# Altium schematic sheet Sheet1.SchDoc
size A
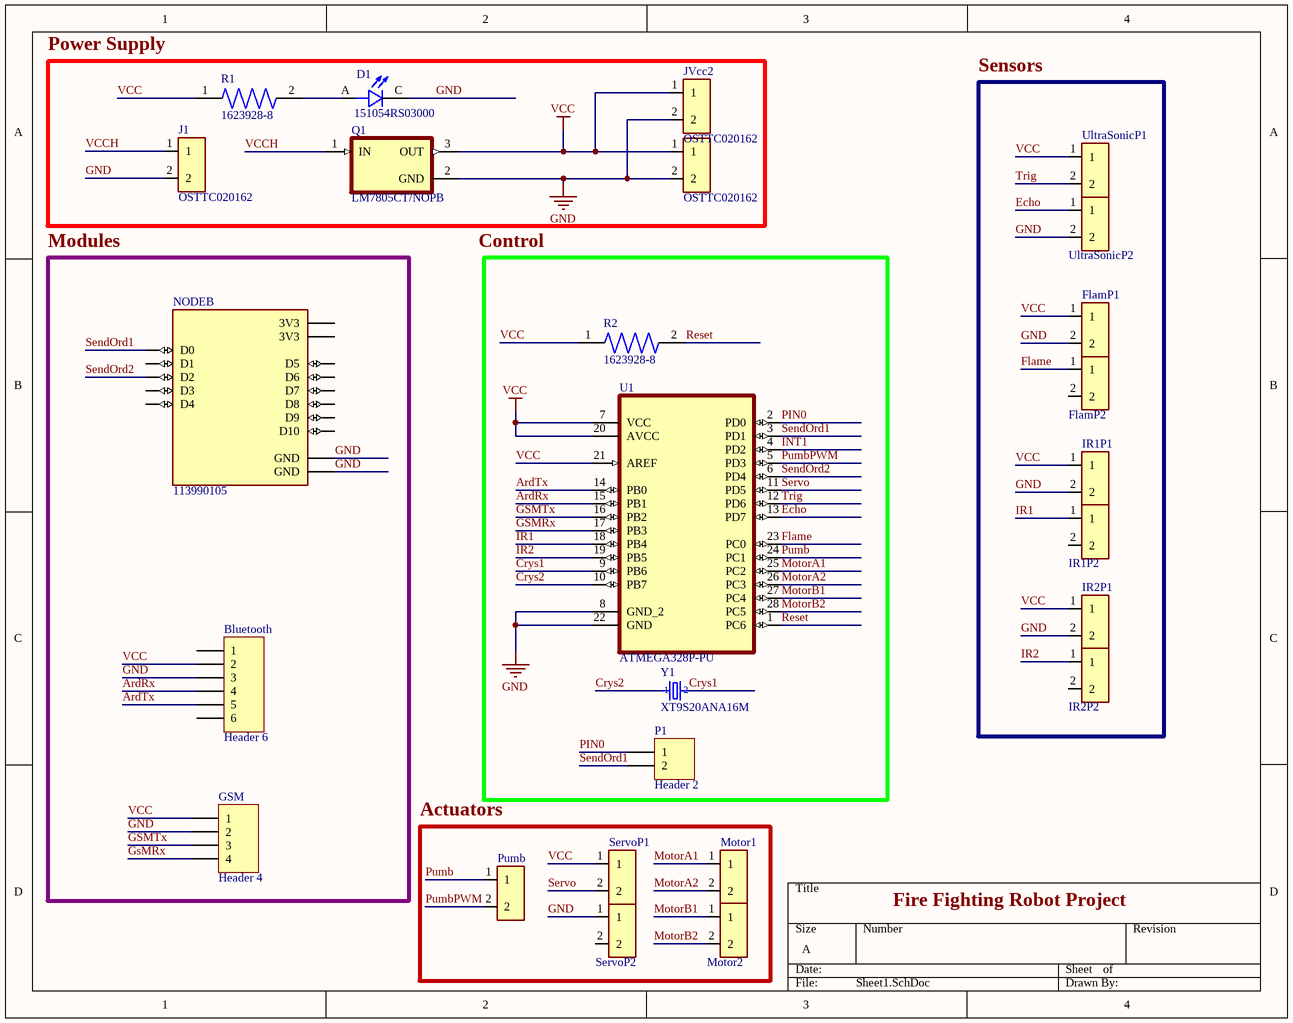
[diagram p0: Sheet1.SchDoc]

## Parts
Bluetooth  Header 6  [HDR1X6]
D1  151054RS03000  [LED_151054RS03000]
FlamP1  (no value)  [OST_OSTTC020162]
FlamP2  (no value)  [OST_OSTTC020162]
GSM  Header 4  [HDR1X4]
IR1P1  (no value)  [OST_OSTTC020162]
IR1P2  (no value)  [OST_OSTTC020162]
IR2P1  (no value)  [OST_OSTTC020162]
IR2P2  (no value)  [OST_OSTTC020162]
J1  OSTTC020162  [OST_OSTTC020162]
JVcc  OSTTC020162  [OST_OSTTC020162]
JVcc2  OSTTC020162  [OST_OSTTC020162]
Motor1  (no value)  [OST_OSTTC020162]
Motor2  (no value)  [OST_OSTTC020162]
NODE  113990105  [SEEED_113990105]  (part B of 2)
P1  Header 2  [HDR1X2]
Pumb  (no value)  [OST_OSTTC020162]
Q1  LM7805CT/NOPB  [TO254P1054X470X2600-3]
R1  1623928-8  [RESAD700W45L350D185]
R2  1623928-8  [RESAD700W45L350D185]
ServoP1  (no value)  [OST_OSTTC020162]
ServoP2  (no value)  [OST_OSTTC020162]
U1  ATMEGA328P-PU  [DIP254P762X457-28]
UltraSonicP1  (no value)  [OST_OSTTC020162]
UltraSonicP2  (no value)  [OST_OSTTC020162]
Y1  XT9S20ANA16M  [XTAL_XT9S20ANA16M]

## Blocks framed on the sheet
Power Supply: D1 J1 JVcc JVcc2 Q1 R1
Sensors: FlamP1 FlamP2 IR1P1 IR1P2 IR2P1 IR2P2 UltraSonicP1 UltraSonicP2
Modules: Bluetooth GSM NODE
Actuators: Motor1 Motor2 Pumb ServoP1 ServoP2

## Nets
GND: Bluetooth.3 D1.C FlamP1.2 GSM.2 IR1P1.2 IR2P1.2 J1.2 JVcc.2 JVcc2.2 NODE.J2_7(GND) NODE.J2_14(GND) Q1.2(GND) ServoP2.1 U1.8(GND_2) U1.22(GND) UltraSonicP2.2
VCC: Bluetooth.2 FlamP1.1 GSM.1 IR1P1.1 IR2P1.1 JVcc.1 JVcc2.1 Q1.3(OUT) R1.1 R2.1 ServoP1.1 U1.7(VCC) U1.20(AVCC) U1.21(AREF) UltraSonicP1.1
ArdRx: Bluetooth.4 U1.15(PB1)
ArdTx: Bluetooth.5 U1.14(PB0)
Crys1: U1.9(PB6) Y1.2
Crys2: U1.10(PB7) Y1.1
Echo: U1.13(PD7) UltraSonicP2.1
Flame: FlamP2.1 U1.23(PC0)
GSMRx: GSM.4 U1.17(PB3)
GSMTx: GSM.3 U1.16(PB2)
INT1: U1.4(PD2)
IR1: IR1P2.1 U1.18(PB4)
IR2: IR2P2.1 U1.19(PB5)
MotorA1: Motor1.1 U1.25(PC2)
MotorA2: Motor1.2 U1.26(PC3)
MotorB1: Motor2.1 U1.27(PC4)
MotorB2: Motor2.2 U1.28(PC5)
PIN0: P1.1 U1.2(PD0)
Pumb: Pumb.1 U1.24(PC1)
PumbPWM: Pumb.2 U1.5(PD3)
Reset: R2.2 U1.1(PC6)
SendOrd1: NODE.J2_1(D0) P1.2 U1.3(PD1)
SendOrd2: NODE.J2_3(D2) U1.6(PD4)
Servo: ServoP1.2 U1.11(PD5)
Trig: U1.12(PD6) UltraSonicP1.2
VCCH: J1.1 Q1.1(IN)
NetD1_A: D1.A R1.2

Not connected (* = marked no-connect by the designer): Bluetooth 1 6; FlamP2 2; IR1P2 2; IR2P2 2; NODE J2_2(D1) J2_4(D3) J2_5(D4) J2_6(3V3) J2_8(D5) J2_9(D6) J2_10(D7) J2_11(D8) J2_12(D9) J2_13(D10) J2_15(3V3); ServoP2 2

## Notes on the sheet
- Control
- Fire Fighting Robot Project

## Library data of the parts
Bluetooth = Header 6: Header, 6-Pin; LatestRevisionDate: 17-Jul-2002; LatestRevisionNote: Re-released for DXP Platform.; Publisher: Altium Limited
D1 = 151054RS03000: Red 623nm LED Indication - Discrete 1.9V Radial; MF: {'manufacturer': u'Wurth Elektronik'}; Availability: Unavailable; Price: None; MP: 151054RS03000; Package: None; Value: *
FlamP1 FlamP2 IR1P1 IR1P2 IR2P1 IR2P2 J1 JVcc JVcc2 Motor1 Motor2 Pumb ServoP1 ServoP2 UltraSonicP1 UltraSonicP2 = OSTTC020162: CONN, TERMINAL BLOCK, 5mm, 2 PIN, .42"L x.30"D x .39"H; MF: {'manufacturer': u'On Shore'}; Price: None; MP: OSTTC020162; Package: None; Availability: Unavailable; Value: *
GSM = Header 4: Header, 4-Pin; LatestRevisionDate: 17-Jul-2002; LatestRevisionNote: Re-released for DXP Platform.; Publisher: Altium Limited
NODE = 113990105: NodeMCU v2 - Lua based ESP8266 development kit; MF: {'manufacturer': u'Seeed Technology'}; Price: None; Value: *; Package: None; Availability: Unavailable; MP: 113990105
P1 = Header 2: Header, 2-Pin; LatestRevisionDate: 17-Jul-2002; LatestRevisionNote: Re-released for DXP Platform.; Publisher: Altium Limited
Q1 = LM7805CT/NOPB: Standard Regulator Pos 5V 1A 3-Pin(3+Tab) TO-220 Rail; MF: {'manufacturer': u'ON Semiconductor'}; MP: LM7805CT/NOPB; Value: *; Package: None; Price: None; Availability: Unavailable
R1 R2 = 1623928-8: CFR16 5% 10K; MF: {'manufacturer': u'TE Connectivity'}; Availability: Unavailable; Price: None; MP: 1623928-8; Package: None; Value: *
U1 = ATMEGA328P-PU: 8-bit Microcontroller with In-System Programmable Flash; MF: {'manufacturer': u'Microchip'}; MP: ATMEGA328P-PU; Package: None; Price: None; Value: *; Availability: Unavailable
Y1 = XT9S20ANA16M: Microprocessor, Crystal; 16 MHz; + 30 ppm (Typ.) @ 25 degC; 7 pF (Max.); 40 Ohm; MF: {'manufacturer': u'Vishay Dale'}; Value: *; Package: None; Price: None; MP: XT9S20ANA16M; Availability: Unavailable